# EAGLE design RPi-FabScan-HAT_v12 (EAGLE 7.7.0)
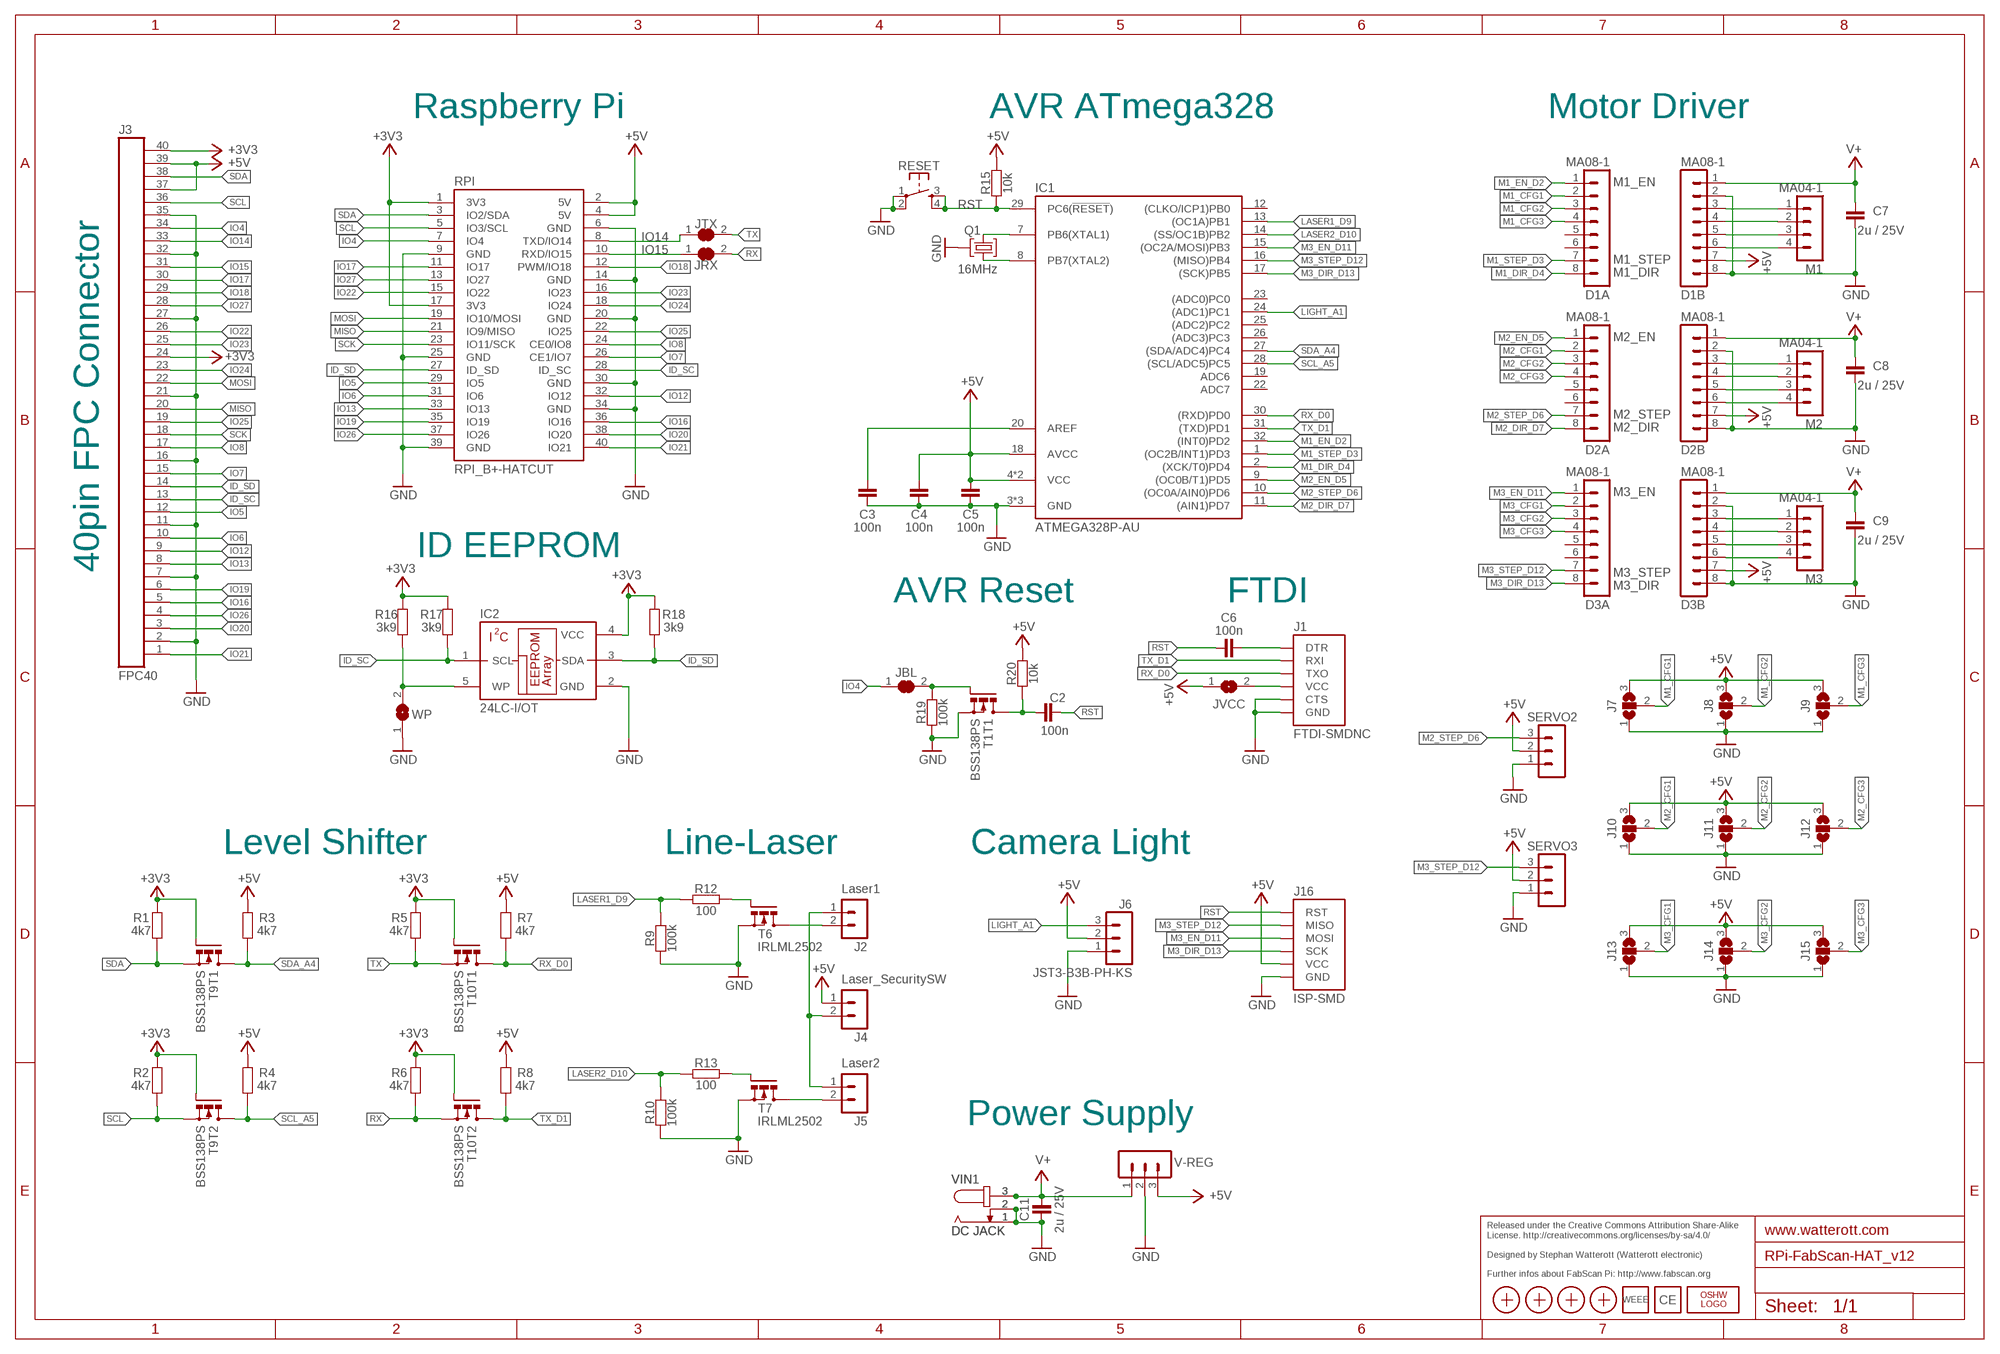
[diagram p0: schematic, sheet 1]

## Parts
1  PASSER-07  [PASSER_07MM]
2  PASSER-07  [PASSER_07MM]
C2  100n  CAPACITOR-0402  [C0402]
C3  100n  CAPACITOR-0402  [C0402]
C4  100n  CAPACITOR-0402  [C0402]
C5  100n  CAPACITOR-0402  [C0402]
C6  100n  CAPACITOR-0402  [C0402]
C7  2u / 25V  CAPACITOR-1206  [C1206]
C8  2u / 25V  CAPACITOR-1206  [C1206]
C9  2u / 25V  CAPACITOR-1206  [C1206]
C11  2u / 25V  CAPACITOR-1206  [C1206]
D1A  MA08-1  [MA08-1]
D1B  MA08-1  [MA08-1]
D2A  MA08-1  [MA08-1]
D2B  MA08-1  [MA08-1]
D3A  MA08-1  [MA08-1]
D3B  MA08-1  [MA08-1]
IC1  ATMEGA328P-AU  [TQFP32]
IC2  24LC-I/OT  [SOT23-5]
J1  FTDI-SMDNC  [FTDI_SMDNC]
J2  Laser1  MA02-1  [MA02-1]
J3  FPC40  [FPC40-0.5]
J4  Laser_SecuritySW  MA02-1  [MA02-1]
J5  Laser2  MA02-1  [MA02-1]
J6  JST3-B3B-PH-KS  [JST_B3B-PH-KS]
J7  JUMPER3-0603-NC  [JUMPER3-0603_NC]
J8  JUMPER3-0603-NC  [JUMPER3-0603_NC]
J9  JUMPER3-0603-NC  [JUMPER3-0603_NC]
J10  JUMPER3-0603-NC  [JUMPER3-0603_NC]
J11  JUMPER3-0603-NC  [JUMPER3-0603_NC]
J12  JUMPER3-0603-NC  [JUMPER3-0603_NC]
J13  JUMPER3-0603-NC  [JUMPER3-0603_NC]
J14  JUMPER3-0603-NC  [JUMPER3-0603_NC]
J15  JUMPER3-0603-NC  [JUMPER3-0603_NC]
J16  ISP-SMD  [ISP-2X3_SMD]
JBL  JUMPER2-0402-NC  [JUMPER2-0402_NC]
JRX  JUMPER2-0402-NC  [JUMPER2-0402_NC]
JTX  JUMPER2-0402-NC  [JUMPER2-0402_NC]
JVCC  JUMPER2-0402-NC  [JUMPER2-0402_NC]
LOGO1  LOGO_CE-2  [CE_2MM]
LOGO2  OSHW_LOGOX0100  [OSHW_6X100]
LOGO3  LOGO_WEEE-4  [WEEE_4MM]
M1  MA04-1  [MA04-1]
M2  MA04-1  [MA04-1]
M3  MA04-1  [MA04-1]
Q1  16MHz  CRYSTAL-RES-32  [CRYSTAL_32X13]
R1  4k7  RESISTOR-0402  [C0402]
R2  4k7  RESISTOR-0402  [C0402]
R3  4k7  RESISTOR-0402  [C0402]
R4  4k7  RESISTOR-0402  [C0402]
R5  4k7  RESISTOR-0402  [C0402]
R6  4k7  RESISTOR-0402  [C0402]
R7  4k7  RESISTOR-0402  [C0402]
R8  4k7  RESISTOR-0402  [C0402]
R9  100k  RESISTOR-0402  [C0402]
R10  100k  RESISTOR-0402  [C0402]
R12  100  RESISTOR-0402  [C0402]
R13  100  RESISTOR-0402  [C0402]
R15  10k  RESISTOR-0402  [C0402]
R16  3k9  RESISTOR-0402  [C0402]
R17  3k9  RESISTOR-0402  [C0402]
R18  3k9  RESISTOR-0402  [C0402]
R19  100k  RESISTOR-0402  [C0402]
R20  10k  RESISTOR-0402  [C0402]
RESET  SW-TACTILE-PTS840P  [SW_PTS840P]
RPI  RPI_B+-HATCUT  [RPI-B+HAT_CUTOUT]
SERVO2  MA03-1  [MA03-1]
SERVO3  MA03-1  [MA03-1]
T1  BSS138PS  [SOT363]
T6  IRLML2502  MOSFET-N-SOT23  [SOT23]
T7  IRLML2502  MOSFET-N-SOT23  [SOT23]
T9  BSS138PS  [SOT363]
T10  BSS138PS  [SOT363]
V-REG  MA03-1  [MA03-1]
VIN  DC JACK  DC-JACK-2.1  [DC-JACK]
VIN1  DC JACK  DC-JACK-2.1  [DC-JACK]
WP  JUMPER2-0402-NC  [JUMPER2-0402_NC]
X1  PASSER-07  [PASSER_07MM]
X4  PASSER-07  [PASSER_07MM]

## Nets
+3V3: IC2.4(VCC) J3.24 J3.40 R1.1 R2.1 R5.1 R6.1 R16.2 R17.2 R18.2 RPI.1(3V3) RPI.17(3V3) T9.2(T1:G) T9.5(T2:G) T10.2(T1:G) T10.5(T2:G)
+5V: C4.2 C5.2 D1B.7 D2B.7 D3B.7 IC1.4(VCC) IC1.6(VCC) IC1.18(AVCC) J3.37 J3.39 J4.1 J6.2 J7.3 J8.3 J9.3 J10.3 J11.3 J12.3 J13.3 J14.3 J15.3 J16.VCC JVCC.1 R3.1 R4.1 R7.1 R8.1 R15.2 R20.2 RPI.2(5V) RPI.4(5V) SERVO2.2 SERVO3.2 V-REG.3
GND: C3.1 C4.1 C5.1 C7.1 C8.1 C9.1 C11.1 D1B.2 D1B.8 D2B.2 D2B.8 D3B.2 D3B.8 IC1.3(GND) IC1.5(GND) IC1.21(GND) IC2.2(GND) J1.1-GND(GND) J1.2-CTS(CTS) J3.2 J3.7 J3.11 J3.16 J3.21 J3.27 J3.32 J3.35 J6.1 J7.1 J8.1 J9.1 J10.1 J11.1 J12.1 J13.1 J14.1 J15.1 J16.GND Q1.GND R9.1 R10.1 R19.1 RESET.1 RESET.2 RPI.6(GND) RPI.9(GND) RPI.14(GND) RPI.20(GND) RPI.25(GND) RPI.30(GND) RPI.34(GND) RPI.39(GND) SERVO2.1 SERVO3.1 T1.1(T1:S) T6.2(S) T7.2(S) V-REG.2 VIN1.1 VIN1.2 VIN.1 VIN.2 WP.1
ID_SC: IC2.1(SCL) J3.13 R17.1 RPI.28(ID_SC)
ID_SD: IC2.3(SDA) J3.14 R18.1 RPI.27(ID_SD)
IO4: J3.34 JBL.1 RPI.7(IO4)
IO5: J3.12 RPI.29(IO5)
IO6: J3.10 RPI.31(IO6)
IO7: J3.15 RPI.26(CE1/IO7)
IO8: J3.17 RPI.24(CE0/IO8)
IO12: J3.9 RPI.32(IO12)
IO13: J3.8 RPI.33(IO13)
IO14: J3.33 JTX.1 RPI.8(TXD/IO14)
IO15: J3.31 JRX.1 RPI.10(RXD/IO15)
IO16: J3.5 RPI.36(IO16)
IO17: J3.30 RPI.11(IO17)
IO18: J3.29 RPI.12(PWM/IO18)
IO19: J3.6 RPI.35(IO19)
IO20: J3.3 RPI.38(IO20)
IO21: J3.1 RPI.40(IO21)
IO22: J3.26 RPI.15(IO22)
IO23: J3.25 RPI.16(IO23)
IO24: J3.23 RPI.18(IO24)
IO25: J3.19 RPI.22(IO25)
IO26: J3.4 RPI.37(IO26)
IO27: J3.28 RPI.13(IO27)
LASER1_D9: IC1.13((OC1A)PB1) R9.2 R12.1
LASER2_D10: IC1.14((SS/OC1B)PB2) R10.2 R13.1
LIGHT_A1: IC1.24((ADC1)PC1) J6.3
M1_CFG1: D1A.2 J7.2
M1_CFG2: D1A.3 J8.2
M1_CFG3: D1A.4 J9.2
M1_DIR_D4: D1A.8 IC1.2((XCK/T0)PD4)
M1_EN_D2: D1A.1 IC1.32((INT0)PD2)
M1_STEP_D3: D1A.7 IC1.1((OC2B/INT1)PD3)
M2_CFG1: D2A.2 J10.2
M2_CFG2: D2A.3 J11.2
M2_CFG3: D2A.4 J12.2
M2_DIR_D7: D2A.8 IC1.11((AIN1)PD7)
M2_EN_D5: D2A.1 IC1.9((OC0B/T1)PD5)
M2_STEP_D6: D2A.7 IC1.10((OC0A/AIN0)PD6) SERVO2.3
M3_CFG1: D3A.2 J13.2
M3_CFG2: D3A.3 J14.2
M3_CFG3: D3A.4 J15.2
M3_DIR_D13: D3A.8 IC1.17((SCK)PB5) J16.SCK
M3_EN_D11: D3A.1 IC1.15((OC2A/MOSI)PB3) J16.MOSI
M3_STEP_D12: D3A.7 IC1.16((MISO)PB4) J16.MISO SERVO3.3
MISO: J3.20 RPI.21(IO9/MISO)
MOSI: J3.22 RPI.19(IO10/MOSI)
N$1: IC1.7(PB6(XTAL1)) Q1.2
N$2: IC1.8(PB7(XTAL2)) Q1.1
N$3: D3B.3 M3.1
N$5: C3.2 IC1.20(AREF)
N$6: R12.2 T6.1(G)
N$7: R13.2 T7.1(G)
N$9: C6.1 J1.6-DTR(DTR)
N$11: J2.1 J4.2 J5.1
N$12: JBL.2 R19.2 T1.2(T1:G)
N$14: C2.2 R20.1 T1.6(T1:D)
N$15: J2.2 T6.3(D)
N$17: D3B.4 M3.2
N$22: D3B.5 M3.3
N$23: D3B.6 M3.4
N$25: D2B.3 M2.1
N$26: D2B.4 M2.2
N$27: D2B.5 M2.3
N$28: D2B.6 M2.4
N$30: D1B.3 M1.1
N$31: D1B.4 M1.2
N$32: D1B.5 M1.3
N$33: D1B.6 M1.4
N$35: J5.2 T7.3(D)
N$36: IC2.5(WP) R16.1 WP.2
RST: C2.1 C6.2 IC1.29(PC6(!RESET!)) J16.RST R15.1 RESET.3(S1) RESET.4(S2)
RX: JRX.2 R6.2 T10.4(T2:S)
RX_D0: IC1.30((RXD)PD0) J1.4-TXO(TXO) R7.2 T10.6(T1:D)
SCK: J3.18 RPI.23(IO11/SCK)
SCL: J3.36 R2.2 RPI.5(IO3/SCL) T9.4(T2:S)
SCL_A5: IC1.28((SCL/ADC5)PC5) R4.2 T9.3(T2:D)
SDA: J3.38 R1.2 RPI.3(IO2/SDA) T9.1(T1:S)
SDA_A4: IC1.27((SDA/ADC4)PC4) R3.2 T9.6(T1:D)
TX: JTX.2 R5.2 T10.1(T1:S)
TX_D1: IC1.31((TXD)PD1) J1.5-RXI(RXI) R8.2 T10.3(T2:D)
V+: C7.2 C8.2 C9.2 C11.2 D1B.1 D2B.1 D3B.1 V-REG.1 VIN1.3 VIN.3
VCC_FTDI: J1.3-VCC(VCC) JVCC.2
Unconnected: D1A.5 D1A.6 D2A.5 D2A.6 D3A.5 D3A.6 IC1.12((CLKO/ICP1)PB0) IC1.19(ADC6) IC1.22(ADC7) IC1.23((ADC0)PC0) IC1.25((ADC2)PC2) IC1.26((ADC3)PC3) T1.3(T2:D) T1.4(T2:S) T1.5(T2:G)

## Notes on the sheet
- Raspberry Pi | AVR ATmega328 | Motor Driver
- M1_EN
- M1_STEP
- M1_DIR
- M2_EN
- 40pin FPC Connector
- M2_STEP
- M2_DIR
- M3_EN
- ID EEPROM
- M3_STEP
- M3_DIR
- AVR Reset | FTDI
- Level Shifter | Line-Laser | Camera Light
- Power Supply
- Released under the Creative Commons Attribution Share-Alike 
  License. http://creativecommons.org/licenses/by-sa/4.0/
  
  Designed by Stephan Watterott (Watterott electronic)
  
  Further infos about FabScan Pi: http://www.fabscan.org

## Library data of the parts
1 2 X1 X4 = we-symbol:PASSER
C2-C9 C11 = we-rcl:CAPACITOR: Capacitors ...2.2uF @ 6.3V -> 0402 ...4.7uF @ 6.3V -> 0603 ...10uF @ 16V -> 0805 ...22uF @ 25V -> 1206
D1A D1B D2A D2B D3A D3B = we-con:MA08-1: Pin Header
IC1 = we-chip:ATMEGA328P: Atmel ATmega48/88/168/328 AVR Microcontroller
IC2 = we-chip:24LC*: Microchip I2C EEPROM 2 Kbit - 24LC02B - 24LC02BT-I/OTDKR-ND 32 Kbit- 24LC32A - 24LC32AT-I/OTDKR-ND; DIGIKEY: 24LC32AT-I/OTDKR-ND
J1 = we-board:FTDI: FTDI 6pol connector
J2 J4 J5 = we-con:MA02-1: Pin Header
J3 = we-con:FPC40: FPC/ZIF Connector FCI 62684-402100AHLF -> 40 Pins 0.5mm top contact FCI 62684-401100AHLF -> 40 Pins 0.5mm bottom contact; DIGIKEY_BOT: 62684-401100AHLF-ND; DIGIKEY_TOP: 62684-402100AHLF-ND
J6 = we-con:JST3: JST Connector
J7-J15 = we-rcl:JUMPER3: 3 Pin Jumpers
J16 = we-board:ISP: AVR ISP connector
JBL JRX JTX JVCC WP = we-rcl:JUMPER2: 2 Pin Jumpers
LOGO1 = we-symbol:LOGO_CE: CE Logo
LOGO2 = we-symbol:OSHW_LOGO
LOGO3 = we-symbol:LOGO_WEEE: WEEE Logo
M1-M3 = we-con:MA04-1: Pin Header
Q1 = we-rcl:CRYSTAL-RES: Crystal Resonators 8MHz and 16MHz -> 32x13
R1-R10 R12 R13 R15-R20 = we-rcl:RESISTOR: Resistors all kinds in 0402 and 0603
RESET = we-switch:SW-TACTILE: Tactile Switches; DIGIKEY: CKN10511DKR-ND
RPI = we-board:RPI_B+: Raspberry Pi 1 B+ or Pi 2 or Pi 3 or Pi Zero
SERVO2 SERVO3 V-REG = we-con:MA03-1: Pin Header
T1 T9 T10 = we-transistor:BSS138PS: BSS138 Dual N-Channel MOSFET (UGS +/-20V, RDS 1Ohm, ID 320mA)
T6 T7 = we-transistor:MOSFET-N: N-Channel MOSFET (e.g. IRLML2502, BSS138)
VIN VIN1 = we-con:DC-JACK: DC Jack (2.1mm and 2.5mm)

## Board
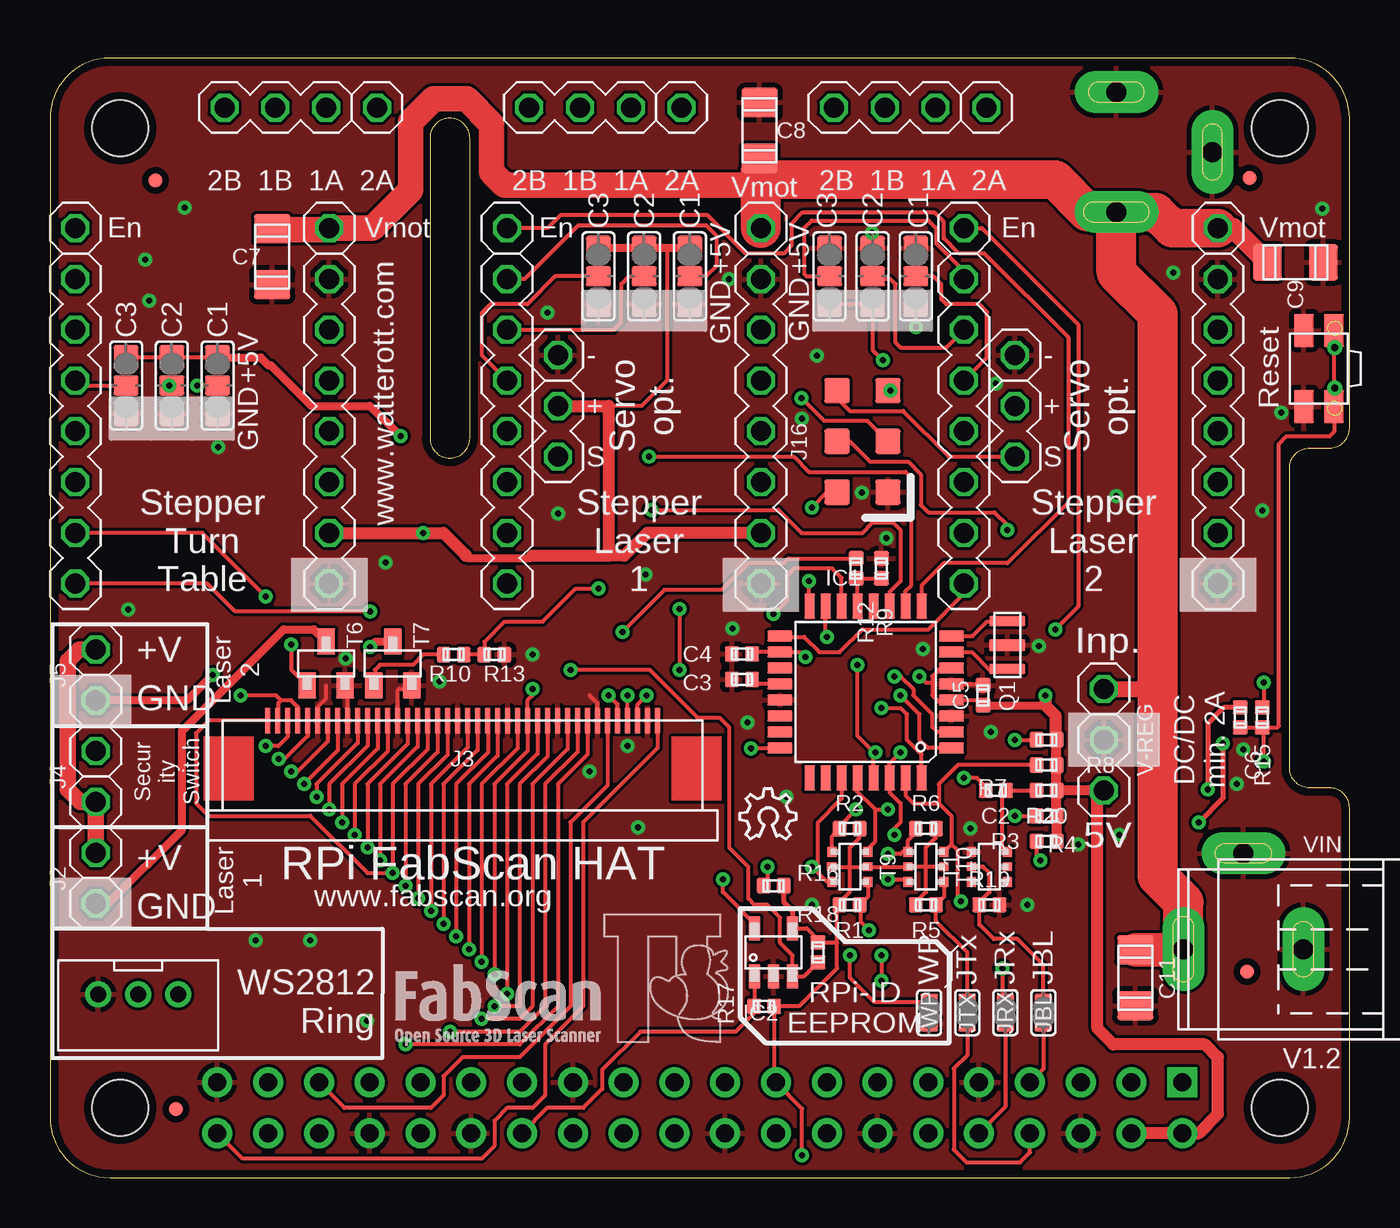
[diagram p1: board, top side]
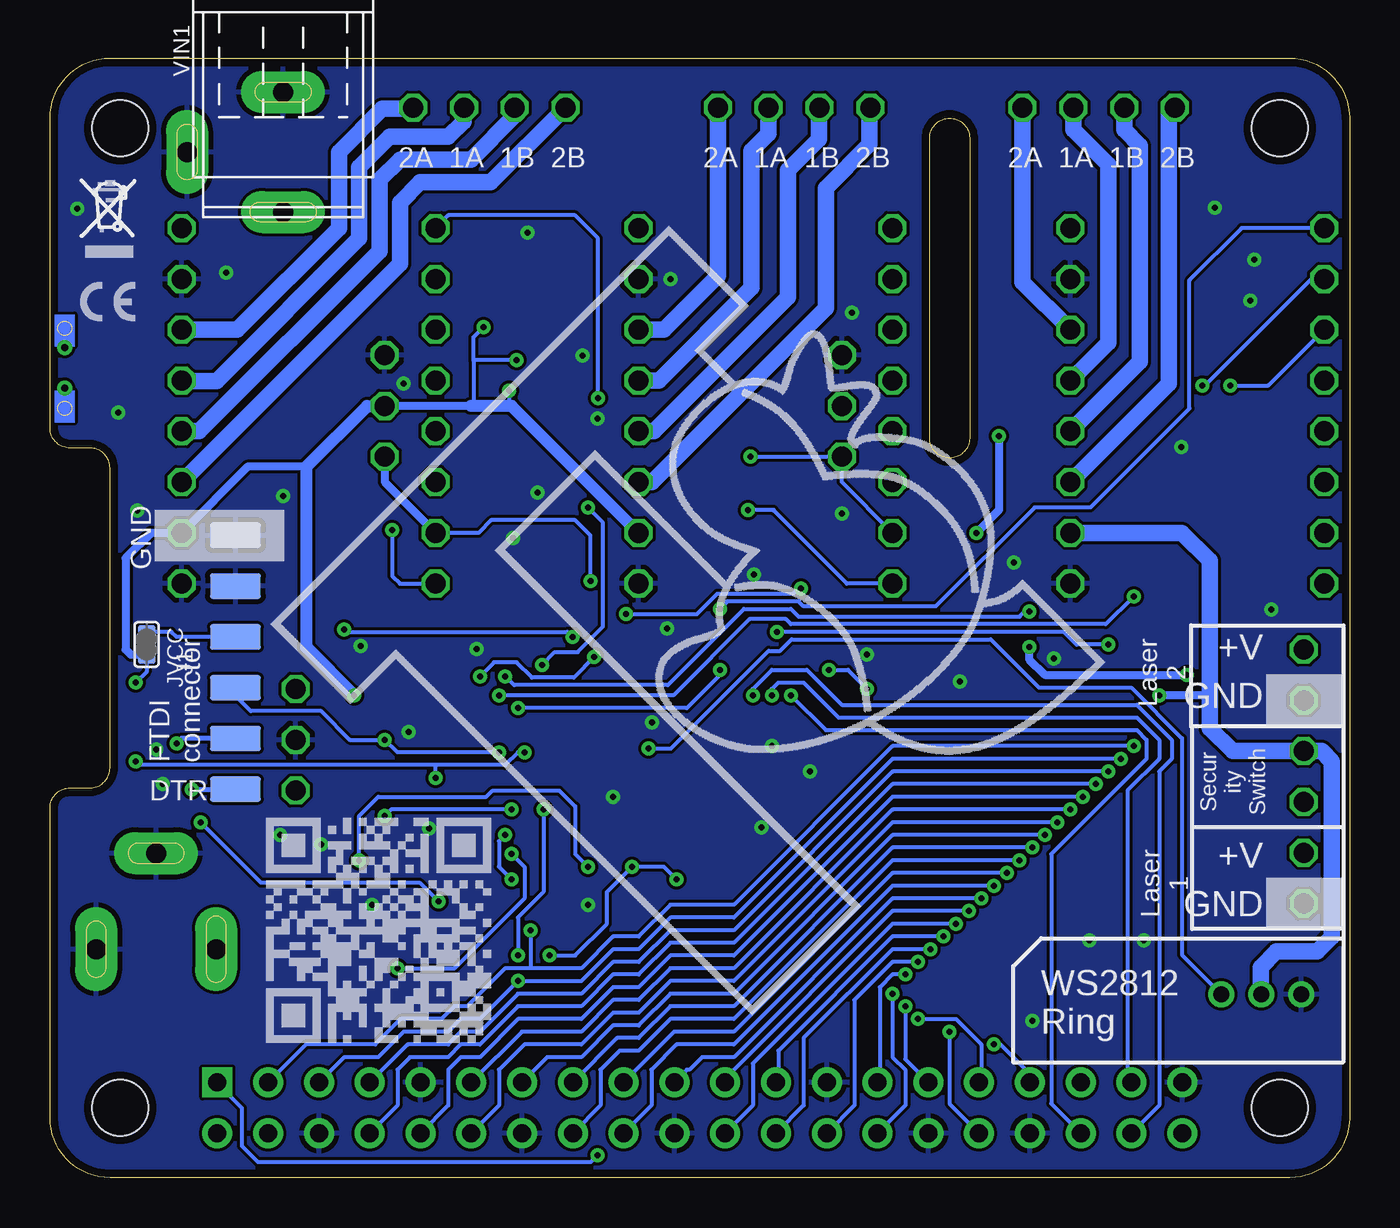
[diagram p2: board, bottom side, seen from below]

Size 65 x 56 mm. Coordinates in mm from the lower left corner, seen from the top.
Copper layers (1*16): Top 0.035mm / dielectric 1.5mm / Bottom 0.035mm
Design rules "we-dru-2-layer": minimum track width 0.15mm, minimum drill 0.3mm, track to track 0.15mm, track to pad 0.15mm, pad to pad 0.15mm, via to via 0.15mm, smd to smd 0.1mm, copper to edge 0.4mm, drill to drill 0.2mm, minimum pad ring 0.18mm, minimum via ring 0.2mm, stop-mask expansion 0.1mm, vias tented up to drill 0.5mm, thermal gap 0.25mm

### Footprints (pad centres in the part's own frame; a part is rotated, then mirrored left to right if it is on the bottom)
PASSER_07MM = smd 0.7 x 0.7: X 0,0
C0402 = smd 0.75 x 0.7: 1 0,0.5; 2 0,-0.5
C1206 = smd 1.8 x 1.45: 1 0,1.4; 2 0,-1.4
MA08-1 = drill 1 octagon: 1 0,8.89; 2 0,6.35; 3 0,3.81; 4 0,1.27; 5 0,-1.27; 6 0,-3.81; 7 0,-6.35; 8 0,-8.89
TQFP32 = smd 1.27 x 0.559: 1 -4.293,2.8; 2 -4.293,2; 3 -4.293,1.2; 4 -4.293,0.4; 5 -4.293,-0.4; 6 -4.293,-1.2; 7 -4.293,-2; 8 -4.293,-2.8; 17 4.293,-2.8; 18 4.293,-2; 19 4.293,-1.2; 20 4.293,-0.4; 21 4.293,0.4; 22 4.293,1.2; 23 4.293,2; 24 4.293,2.8 | smd 0.559 x 1.27: 9 -2.8,-4.293; 10 -2,-4.293; 11 -1.2,-4.293; 12 -0.4,-4.293; 13 0.4,-4.293; 14 1.2,-4.293; 15 2,-4.293; 16 2.8,-4.293; 25 2.8,4.293; 26 2,4.293; 27 1.2,4.293; 28 0.4,4.293; 29 -0.4,4.293; 30 -1.2,4.293; 31 -2,4.293; 32 -2.8,4.293
SOT23-5 = smd 1.2 x 0.6: 1 -1.2,0.95; 2 -1.2,0; 3 -1.2,-0.95; 4 1.2,-0.95; 5 1.2,0.95
FTDI_SMDNC = smd 2.54 x 1.27: 1-GND 0,6.35; 2-CTS 0,3.81; 3-VCC 0,1.27; 4-TXO 0,-1.27; 5-RXI 0,-3.81; 6-DTR 0,-6.35
MA02-1 = drill 1 octagon: 1 0,1.27; 2 0,-1.27
FPC40-0.5 = smd 1.27 x 0.279: 1 0,9.75; 2 0,9.25; 3 0,8.75; 4 0,8.25; 5 0,7.75; 6 0,7.25; 7 0,6.75; 8 0,6.25; 9 0,5.75; 10 0,5.25; 11 0,4.75; 12 0,4.25; 13 0,3.75; 14 0,3.25; 15 0,2.75; 16 0,2.25; 17 0,1.75; 18 0,1.25; 19 0,0.75; 20 0,0.25; 21 0,-0.25; 22 0,-0.75; 23 0,-1.25; 24 0,-1.75; 25 0,-2.25; 26 0,-2.75; 27 0,-3.25; 28 0,-3.75; 29 0,-4.25; 30 0,-4.75; 31 0,-5.25; 32 0,-5.75; 33 0,-6.25; 34 0,-6.75; 35 0,-7.25; 36 0,-7.75; 37 0,-8.25; 38 0,-8.75; 39 0,-9.25; 40 0,-9.75
JST_B3B-PH-KS = drill 0.8 pad 1.3: 1 0,2; 2 0,0; 3 0,-2
JUMPER3-0603_NC = smd 1.25 x 1.25: 1 0,1.4; 3 0,-1.4 | smd 1.25 x 1: 2 0,0
ISP-2X3_SMD = smd 1.27 x 1.27: GND 1.27,-2.54; MISO -1.27,2.54; MOSI 1.27,0; RST -1.27,-2.54; SCK -1.27,0; VCC 1.27,2.54
JUMPER2-0402_NC = smd 0.9 x 0.8: 1 0,0.55; 2 0,-0.55
MA04-1 = drill 1 octagon: 1 0,3.81; 2 0,1.27; 3 0,-1.27; 4 0,-3.81
CRYSTAL_32X13 = smd 1.8 x 0.5: 1 0,1.2; 2 0,-1.2 | smd 1.8 x 0.6: GND 0,0
SW_PTS840P = smd 1.65 x 1: 1 -1.9,0.75; 2 1.9,0.75; 3 -1.9,-0.75; 4 1.9,-0.75
RPI-B+HAT_CUTOUT = drill 0.9 pad 1.5 square: 1 56.63,4.77 | drill 0.9 pad 1.5: 2 56.63,2.23; 3 54.09,4.77; 4 54.09,2.23; 5 51.55,4.77; 6 51.55,2.23; 7 49.01,4.77; 8 49.01,2.23; 9 46.47,4.77; 10 46.47,2.23; 11 43.93,4.77; 12 43.93,2.23; 13 41.39,4.77; 14 41.39,2.23; 15 38.85,4.77; 16 38.85,2.23; 17 36.31,4.77; 18 36.31,2.23; 19 33.77,4.77; 20 33.77,2.23; 21 31.23,4.77; 22 31.23,2.23; 23 28.69,4.77; 24 28.69,2.23; 25 26.15,4.77; 26 26.15,2.23; 27 23.61,4.77; 28 23.61,2.23; 29 21.07,4.77; 30 21.07,2.23; 31 18.53,4.77; 32 18.53,2.23; 33 15.99,4.77; 34 15.99,2.23; 35 13.45,4.77; 36 13.45,2.23; 37 10.91,4.77; 38 10.91,2.23; 39 8.37,4.77; 40 8.37,2.23 | hole 2.8: 3.5,3.5; 3.5,52.5; 61.5,52.5; 61.5,3.5
MA03-1 = drill 1 octagon: 1 0,2.54; 2 0,0; 3 0,-2.54
SOT363 = smd 0.5 x 0.5: 1 -0.9,0.75; 3 -0.9,-0.75; 4 0.9,-0.75; 6 0.9,0.75 | smd 0.5 x 0.4: 2 -0.9,0; 5 0.9,0
SOT23 = smd 1.3 x 0.9: 1 -1.1,0.95; 2 -1.1,-0.95; 3 1.1,0
DC-JACK = drill 1 pad 2.1 long: 1 3,0; 2 0,4.8; 3 -3,0

### Placement (x,y rotation side)
1  6.3,3.44 0 top
2  59.87,10.3 0 top
C2  47.31,19.37 90 top
C3  34.61,24.92 90 top
C4  34.61,26.19 90 top
C5  46.67,24.13 0 top
C6  59.53,23.02 0 top
C7  11.11,46.07 180 top
C8  35.5,52.39 0 top
C9  62.29,45.78 270 top
C11  54.29,10 180 top
D1A  1.27,38.61 0 top
D1B  13.97,38.61 0 top
D2A  22.86,38.61 0 top
D2B  35.56,38.61 0 top
D3A  45.72,38.61 0 top
D3B  58.42,38.61 0 top
IC1  40.8,24.29 180 top
IC2  36.2,11.27 90 top
J1  55.72,25.78 0 bottom
J2  2.29,14.99 0 top
J3  20.64,22.86 270 top
J4  2.29,20.07 0 top
J5  2.29,25.15 0 top
J6  4.41,9.18 90 top
J7  8.38,39.62 180 top
J8  6.1,39.62 180 top
J9  3.81,39.62 180 top
J10  32,45.09 180 top
J11  29.72,45.09 180 top
J12  27.43,45.09 180 top
J13  38.99,45.09 0 top
J14  41.15,45.09 0 top
J15  43.31,45.09 0 top
J16  40.64,36.83 0 top
JBL  49.69,8.26 180 top
JRX  47.78,8.26 180 top
JTX  45.88,8.26 180 top
JVCC  60.17,26.67 180 bottom
LOGO1  62.1,43.81 0 bottom
LOGO2  34.5,16.94 0 top
LOGO3  62.1,48.01 0 bottom
M1  12.54,53.53 270 top
M2  27.78,53.53 270 top
M3  43.02,53.53 270 top
Q1  47.88,26.64 0 top
R1  40.01,13.65 90 top
R2  40.01,17.46 270 top
R3  49.85,16.83 270 top
R4  49.85,18.1 270 top
R5  43.81,13.65 90 top
R6  43.81,17.46 270 top
R7  49.85,21.91 270 top
R8  49.85,20.64 270 top
R9  41.59,30.48 0 top
R10  22.23,26.16 270 top
R12  40.32,30.48 180 top
R13  20.19,26.16 270 top
R15  60.64,23.02 180 top
R16  36.2,14.61 90 top
R17  35.72,8.57 90 top
R18  38.42,11.27 180 top
R19  46.99,13.65 270 top
R20  49.85,19.37 90 top
RESET  63.47,40.48 90 top
RPI  0,0 0 top
SERVO2  25.4,38.61 0 top
SERVO3  48.26,38.61 0 top
T1  46.99,15.56 0 top
T6  13.81,25.72 90 top
T7  17.14,25.72 90 top
T9  40.01,15.56 180 top
T10  43.81,15.56 180 top
V-REG  52.7,21.91 0 top
VIN  59.69,11.43 0 top
VIN1  53.34,51.31 90 bottom
WP  43.97,8.26 180 top
X1  5.29,49.87 0 top
X4  60,50 0 top

### Tracks (layer width: path | path; a pad name or v marks a point on that pad's centre or on a via)
+3V3  (via drill 0.3)
  Top 0.2: J3.24 18.89,21.43 17.14,19.68 v17.14,15.24 15.88,15.24 13.02,18.1 7.94,18.1 7.3,18.73 7.3,22.23 7.94,22.86 J3.40 | T10.2 43.81,15.56 | 43.81,15.56 T10.5 T9.2 40.01,15.56 | T9.5 40.01,15.56 | 39.45,13.74 39.51,13.79 | 39.51,13.79 40.01,14.29 40.01,15.56 | 43.81,15.56 43.81,14.29 43.27,13.74 43.27,13.7 R5.1 | 39.37,11.75 39.37,10.48 37.47,8.57 R17.2 36.22,4.86 RPI.17 | 39.37,11.75 39.37,13.57 39.45,13.65 R1.1 39.51,13.79 | IC2.4 37.85,12.47 38.42,11.91 R18.2 39.35,11.77 39.37,11.75 | 36.27,4.81 RPI.17 | v37.62,1.11 37.62,3.46 RPI.17 | 43.81,15.56 43.81,16.51 44.29,16.99 44.29,17.44 R6.1 | 40.01,15.56 40.01,16.51 40.48,16.99 40.48,17.44 R2.1 | 36.7,13.79 36.74,13.74
  Top 0.254: 36.74,13.74 37.15,13.34 IC2.4 | R16.2 36.7,13.79
  Bottom 0.2: v17.14,15.24 22.86,15.24 30.8,7.3 33.78,7.3 RPI.17 | RPI.1 56.63,4.72 55.4,3.49 55.4,1.59 54.61,0.79 37.94,0.79 v37.62,1.11
+5V  (via drill 0.3)
  Top 0.2: IC1.6 44.54,25.49 44.13,25.08 44.13,24.77 | 44.13,24.77 44.13,24.13 44.45,23.81 45.02,23.81 IC1.4 46.41,23.89 C5.2 | v37.78,26.04 37.53,26.29 IC1.18 35.2,26.29 C4.2 | v43.5,25.08 43.81,24.77 44.13,24.77 | J7.3 J8.3 J9.3 | v60.71,24.77 60.71,23.58 R15.2 | J3.37 12.39,23.55 12.06,23.88 11.56,23.88 | J3.39 11.39,23.33 11.43,23.37 11.43,23.75 11.56,23.88 | v9.53,24.13 11.3,24.13 11.56,23.88 | J12.3 30.86,46.48 30.86,39.88 29.59,38.61 27.94,38.61 | J13.3 J14.3 41.15,41.4 v41.66,40.89 | v43.31,42.55 J15.3 | J16.VCC v42.04,39.37
  Top 0.254: 43.31,43.24 43.5,43.24 43.5,43.69 J15.3 43.31,44.07
  Top 0.406: J7.3 10.54,41.02 10.92,40.64 11.05,40.64 13.08,38.61 16,38.61 v17.53,37.08 | C5.2 49.78,23.63 49.78,23.64 | 50.29,21.96 R7.1 | J10.3 J11.3 J12.3 | 24.13,31.11 24,30.99 20.92,30.99 20.8,31.11
  Top 0.5: V-REG.3 R20.2 | R20.2 R8.1 R7.1 | R20.2 R4.1 R3.1
  Top 0.61: V-REG.3 52.39,19.05 52.39,7.46 53.18,6.67 57.78,6.67 58.42,6.03 58.42,3.17 57.48,2.23 RPI.2 RPI.4 | D1B.7 v18.67,32.26 19.68,32.26 20.8,31.15 20.8,31.11 | 49.78,23.63 50.29,23.11 50.29,21.96 | v49.78,24.13 49.78,23.64 | SERVO2.2 27.94,38.61 27.94,31.11 | D2B.7 29.88,32.26 28.73,31.11 27.94,31.11 | 24.13,31.11 27.94,31.11
  Bottom 0.2: JVCC.1 60.17,25.3 v60.71,24.77 | 43.81,40.89 43.81,38.73 43.94,38.61 | v41.66,40.89 43.81,40.89 | 43.81,40.89 43.81,42.04 v43.31,42.55 | v42.04,39.37 42.04,38.61 | v37.78,26.04 38.8,25.02 40.89,25.02 41.66,25.78 42.8,25.78 v43.5,25.08
  Bottom 0.406: v17.53,37.08 17.53,33.4 v18.67,32.26 | JVCC.1 60.21,26.16 60.96,26.16 61.21,26.42 61.21,30.99 59.94,32.26 D3B.7 55.12,35.56 52.2,35.56 | 43.94,38.61 SERVO3.2 | 6.99,24.13 v9.53,24.13
  Bottom 0.61: SERVO3.2 49.15,38.61 52.2,35.56 52.2,26.54 v49.78,24.13 | D2B.7 41.91,38.61 42.04,38.61 43.94,38.61
  Bottom 0.813: D1B.7 8.38,32.26 6.99,30.86 6.99,24.13 6.99,22.48 5.84,21.34 J4.1 1.4,21.34 0.89,20.83 0.89,12.04 1.62,11.31 3.66,11.31 4.44,10.53 4.44,9.21 J6.2
GND  (via drill 0.3)
  Top 0.2: J3.7 27.39,23.73 26.99,24.13 | J3.32 14.89,24.49 T6.2 14.75,24.61 | IC1.5 46.66,24.69 | J3.27 17.39,24.37 17.46,24.45 18.08,24.45 | J3.35 13.39,23.55 13.81,23.97 13.81,24.61
  other vias: 25.4,33.21 48.9,13.65 46.04,17.46 38.1,13.65 29.4,17.53 28.89,21.59 26.99,20.32 24.13,26.16 19.49,24.83 14.8,25.97 4.95,43.88 4.76,45.91 6.73,48.51 15.87,7.85 13.02,11.87 10.29,11.87 36.83,19.05 49.47,26.61 37.62,37.97 34.13,27.46 8.41,36.54 33.97,44.96 41.12,47.28 47.31,39.72 41.85,32 38.35,41.12 56.2,45.28 63.63,48.48 61.59,38.26 59.37,19.68 53.5,17.14 51.44,16.67 3.91,28.42 29.78,30.16 16.8,30.77 60.64,33.37 59.69,21.43 53.34,34.1 40.61,34.26 47.05,22.29 24.89,43.28 34.89,22.76 43.66,26.45
  pour Top: 0,0 0,55.88 65.09,55.88 65.09,0
  pour Bottom: 0,0 0,55.88 0,56.04 64.93,56.04 64.93,55.88 64.93,50.8 64.93,33.02 64.93,21.91 64.93,12.06 64.93,2.38 64.93,0
ID_SC  (via drill 0.3)
  Top 0.2: J3.13 24.39,21.21 22.86,19.68 v22.86,9.21 | IC2.1 35.24,8.6 R17.1 35.22,8.23 34.29,7.3 29.53,7.3 27.62,5.4 27.62,4.45 26.67,3.49 24.87,3.49 RPI.28
  Bottom 0.2: v22.86,9.21 22.86,6.03 22.23,5.4 22.23,3.62 RPI.28
ID_SD  (via drill 0.3)
  Top 0.2: v22.23,10.16 22.23,19.68 23.89,21.35 J3.14 23.89,23.89 24.13,24.13 v24.13,24.45 | v26.04,25.4 30,25.4 32.38,23.02 33.5,23.02 33.97,22.54 33.97,16.51 34.92,15.56 34.92,13.97 35.24,13.65 35.88,13.65 36.51,13.02 36.51,11.75 37.15,11.12 IC2.3 37.72,10.07 R18.1
  Bottom 0.2: v22.23,10.16 22.86,10.16 23.5,9.53 23.5,4.88 RPI.27 | v26.04,25.4 25.08,25.4 v24.13,24.45
IO4  (via drill 0.3)
  Top 0.2: J3.34 13.89,21.82 12.38,20.32 v12.06,20.32 | JBL.1 49.69,5.45 RPI.7
  Bottom 0.2: v12.06,20.32 22.86,20.32 30.8,12.38 33.97,12.38 35.56,10.79 36.83,10.79 38.42,9.21 41.59,9.21 43.5,7.3 44.45,7.3 45.09,6.67 47.11,6.67 RPI.7
IO5  (via drill 0.3)
  Top 0.2: J3.12 24.89,21.08 23.5,19.68 23.5,8.57 v22.23,8.57
  Bottom 0.2: v22.23,8.57 22.23,5.92 RPI.29
IO6  (via drill 0.3)
  Top 0.2: J3.10 25.89,21.44 24.13,19.68 24.13,8.57 23.5,7.94 v21.59,7.94
  Bottom 0.2: v21.59,7.94 19.68,7.94 18.41,6.67 18.41,4.76 RPI.31
IO7  (via drill 0.3)
  Top 0.2: J3.15 23.39,21.48 21.59,19.68 v21.59,10.79
  Bottom 0.2: v21.59,10.79 22.86,10.79 24.77,8.89 24.77,3.62 RPI.26
IO8  (via drill 0.3)
  Top 0.2: J3.17 22.39,21.12 20.95,19.68 v20.95,11.43
  Bottom 0.2: v20.95,11.43 22.86,11.43 27.3,6.99 27.3,3.62 RPI.24
IO12  (via drill 0.3)
  Top 0.2: J3.9 26.39,21.31 24.77,19.68 24.77,8.57 23.5,7.3 v20,7.3
  Bottom 0.2: v20,7.3 20,3.7 RPI.32
IO13  (via drill 0.3)
  Top 0.2: J3.8 26.89,21.17 25.4,19.68 25.4,8.57 23.5,6.67 v17.78,6.67
  Bottom 0.2: RPI.33 16.19,4.97 16.19,5.4 17.46,6.67 v17.78,6.67
IO14  (via drill 0.3)
  Top 0.2: J3.33 14.39,21.37 v12.7,19.68 | JTX.1 45.88,6.13 45.21,5.46 45.21,1.4 45.85,0.76 48.51,0.76 49.02,1.27 49.02,2.22 RPI.8
  Bottom 0.2: v12.7,19.68 22.86,19.68 30.8,11.75 33.97,11.75 35.56,10.16 36.83,10.16 38.42,8.57 41.59,8.57 43.5,6.67 44.45,6.67 45.09,6.03 46.99,6.03 47.62,5.4 47.62,3.62 RPI.8
IO15  (via drill 0.3)
  Top 0.2: J3.31 15.39,21.74 13.34,19.68 v13.34,19.05 | JRX.1 47.78,3.54 RPI.10
  Bottom 0.2: v13.34,19.05 22.86,19.05 30.8,11.11 33.97,11.11 35.56,9.53 36.83,9.53 38.42,7.94 41.59,7.94 43.5,6.03 44.45,6.03 45.09,5.4 45.09,3.62 RPI.10
IO16  (via drill 0.3)
  Top 0.2: J3.5 28.39,23.68 v27.94,24.13
  Bottom 0.2: v27.94,24.13 26.19,22.38 10.64,22.38 10.16,21.91 10.16,20.95 14.92,16.19 14.92,3.7 RPI.36
IO17  (via drill 0.3)
  Top 0.2: J3.30 15.89,21.6 13.97,19.68 v13.97,18.41
  Bottom 0.2: v13.97,18.41 22.86,18.41 30.8,10.48 33.97,10.48 35.56,8.89 36.83,8.89 38.42,7.3 41.4,7.3 RPI.11
IO18  (via drill 0.3)
  Top 0.2: J3.29 16.39,21.47 14.61,19.68 v14.61,17.78
  Bottom 0.2: v14.61,17.78 22.86,17.78 30.8,9.84 33.97,9.84 35.56,8.26 36.83,8.26 38.42,6.67 41.27,6.67 42.55,5.4 42.55,3.62 RPI.12
IO19
  Top 0.2: J3.6 27.89,19.63 26.04,17.78 26.04,8.57 23.5,6.03 20.64,6.03 19.68,5.08 19.68,4.13 19.05,3.49 14.73,3.49 RPI.35
IO20  (via drill 0.3)
  Top 0.2: J3.3 29.39,23.67 v29.84,24.13
  Bottom 0.2: v29.84,24.13 29.84,24.45 28.89,25.4 27.15,25.4 25.4,23.65 10.64,23.65 8.89,21.91 8.89,20.95 9.53,20.32 9.53,3.62 RPI.38
IO21
  Top 0.2: J3.1 30.39,21.5 26.67,17.78 26.67,8.57 24.77,6.67 24.77,4.13 24.13,3.49 22.86,3.49 22.23,2.86 22.23,1.59 21.59,0.95 9.65,0.95 RPI.40
IO22  (via drill 0.3)
  Top 0.2: J3.26 17.89,21.7 15.88,19.68 v15.88,16.51
  Bottom 0.2: v15.88,16.51 22.86,16.51 30.8,8.57 33.97,8.57 35.56,6.99 36.63,6.99 RPI.15
IO23  (via drill 0.3)
  Top 0.2: J3.25 18.39,21.56 16.51,19.68 v16.51,15.88
  Bottom 0.2: v16.51,15.88 22.86,15.88 30.8,7.94 33.97,7.94 35.56,6.35 36.51,6.35 37.47,5.4 37.47,3.62 RPI.16
IO24  (via drill 0.3)
  Top 0.2: J3.23 19.39,21.29 17.78,19.68 v17.78,14.61
  Bottom 0.2: v17.78,14.61 22.86,14.61 30.8,6.67 33.66,6.67 34.92,5.4 34.92,3.62 RPI.18
IO25  (via drill 0.3)
  Top 0.2: J3.19 21.39,21.39 19.68,19.68 v19.68,12.7
  Bottom 0.2: v19.68,12.7 22.86,12.7 29.84,5.71 29.84,3.62 RPI.22
IO26  (via drill 0.3)
  Top 0.2: J3.4 v28.89,24.12 v28.89,24.13
  Bottom 0.2: v28.89,24.13 28.89,24.45 28.57,24.77 27.3,24.77 25.56,23.02 10.64,23.02 9.53,21.91 9.53,20.95 11.11,19.37 11.11,4.97 RPI.37
IO27  (via drill 0.3)
  Top 0.2: J3.28 16.89,21.33 15.24,19.68 v15.24,17.14
  Bottom 0.2: v15.24,17.14 22.86,17.14 30.8,9.21 33.97,9.21 35.56,7.62 36.83,7.62 38.42,6.03 40.13,6.03 RPI.13
LASER1_D9
  Top 0.2: IC1.13 40.4,29.85 40.51,29.85 40.64,29.98 | R12.1 40.64,29.98 | 40.64,29.98 R9.2
LASER2_D10  (via drill 0.3)
  Top 0.2: R13.1 R10.2 21.73,26.8 22.73,27.81 24.64,27.81 26.29,29.46 v27.43,29.46 | IC1.14 39.6,30 39.12,30.48 37.21,30.48 36.83,30.1 36.83,28.83 v36.2,28.19
  Bottom 0.2: v36.2,28.19 32.64,28.19 31.62,29.21 27.81,29.21 27.56,29.46 v27.43,29.46
LIGHT_A1  (via drill 0.3)
  Top 0.2: IC1.24 36.48,21.46 v35.05,21.46
  Bottom 0.2: J6.3 8.38,11.15 8.38,21.97 10.92,24.51 15.53,24.51 17.94,26.92 27.91,26.92 28.48,26.35 29.05,26.35 33.94,21.46 v35.05,21.46
M1_CFG1  (via drill 0.3)
  Top 0.2: J7.2 v7.37,39.62
  Bottom 0.2: v7.37,39.62 7.24,39.62 1.91,44.96 D1A.2
M1_CFG2  (via drill 0.3)
  Top 0.2: J8.2 v5.97,39.62
  Bottom 0.2: v5.97,39.62 4.06,39.62 D1A.3
M1_CFG3
  Top 0.2: D1A.4 1.52,39.62 J9.2
M1_DIR_D4  (via drill 0.3)
  Top 0.2: IC1.2 44.39,22.29 44.13,22.54 44.13,23.18 43.18,24.13 43.18,24.45 42.55,25.08 v42.23,25.08 | v16,28.32 9.27,28.32 7.87,29.72 D1A.8
  Bottom 0.2: v42.23,25.08 41.78,24.64 34.1,24.64 30.29,28.45 27.94,28.45 27.56,28.07 16.51,28.07 16.26,28.32 v16,28.32
M1_EN_D2  (via drill 0.3)
  Top 0.2: IC1.32 43.6,21.17 42.86,21.91 42.86,23.18 42.55,23.5 v41.59,23.5 | v31.5,28.45 v31.5,25.4
  Bottom 0.2: D1A.1 5.4,47.5 8,44.9 8,38.48 12.95,33.53 15.75,33.53 20.7,28.57 27.3,28.57 27.56,28.83 31.11,28.83 v31.5,28.45 | v41.59,23.5 33.15,23.5 31.5,25.15 v31.5,25.4
M1_STEP_D3  (via drill 0.3)
  Top 0.2: IC1.1 43.92,21.49 43.5,21.91 43.5,23.18 v42.55,24.13 | v10.79,29.08 7.62,32.26 D1A.7
  Bottom 0.2: v42.55,24.13 33.81,24.13 30,27.94 28.19,27.94 27.94,27.69 12.19,27.69 v10.79,29.08
M2_CFG1
  Top 0.2: D2A.2 23.75,44.96 26.42,47.62 32.84,47.62 33.33,47.13 33.33,45.6 32.82,45.09 J10.2
M2_CFG2
  Top 0.2: D2A.3 28.19,42.42 28.57,42.8 28.57,44.7 28.96,45.09 J11.2
M2_CFG3
  Top 0.2: J12.2 25.27,45.09 23.88,43.69 22.04,43.69 21.59,43.24 21.59,41.15 D2A.4
M2_DIR_D7  (via drill 0.3)
  Top 0.2: IC1.11 42,29.3 42.55,29.84 42.55,32.38 42.16,32.77 41.15,32.77 40.64,32.26 37.59,32.26 36.45,33.4 v30.1,33.4
  Bottom 0.2: D2A.8 25.15,29.72 28.8,33.37 28.8,33.4 v30.1,33.4
M2_EN_D5
  Top 0.2: IC1.9 43.6,29.63 44.7,30.73 47.88,30.73 50.93,33.78 50.93,42.04 46.74,46.23 45.47,46.23 44.7,46.99 44.7,47.82 44.26,48.26 37.62,48.26 37.08,47.72 37.08,46.61 36.7,46.23 34.8,46.23 32.89,48.13 25.53,48.13 24.89,47.5 D2A.1
M2_STEP_D6  (via drill 0.3)
  Top 0.2: IC1.10 42.8,29.34 43.05,29.59 43.05,35.05 42.8,35.31 37.97,35.31 37.21,36.07 v29.97,36.07
  Bottom 0.2: D2A.7 25.4,34.8 SERVO2.3 v29.97,36.07
M3_CFG1
  Top 0.2: D3A.2 45.59,44.96 45.59,45.47 44.32,46.74 44.32,47.5 43.94,47.88 38.1,47.88 37.72,47.5 37.72,45.21 37.85,45.09 J13.2
M3_CFG2
  Top 0.2: 41.53,45.09 J14.2 41.27,44.96 42.04,44.96 42.29,44.7 42.29,41.78 42.55,41.53 44.83,41.53 D3A.3
M3_CFG3
  Top 0.2: D3A.4 46.86,41.02 46.86,43.31 46.48,43.69 44.83,43.69 44.58,43.94 44.58,44.7 44.2,45.09 J15.2
M3_DIR_D13  (via drill 0.3)
  Top 0.2: IC1.17 36.54,27.05 37.72,27.05 38.48,26.29 39.5,26.29 40.64,27.43 43.94,27.43 45.72,29.21 D3A.8 | J16.SCK 40.01,36.83 41.02,35.81 42.93,35.81 43.56,35.18 43.56,33.66 43.94,33.27 47.24,33.27 47.88,32.64 v47.88,32.38
  Bottom 0.2: v47.88,32.38 47.88,30.1 47.5,29.72 D3A.8
M3_EN_D11  (via drill 0.3)
  Top 0.2: D3A.1 46.61,47.5 51.44,42.67 51.44,28.57 v50.29,27.43 | v38.86,27.05 38.8,27.11 IC1.15 | J16.MOSI 40.89,37.85 38.73,37.85 v37.59,38.99
  Bottom 0.2: v38.86,27.05 39.12,27.3 50.16,27.3 v50.29,27.43 | v37.59,38.99 37.59,46.99 38.73,48.13 45.09,48.13 D3A.1
M3_STEP_D12  (via drill 0.3)
  Top 0.2: IC1.16 37.97,28.61 v37.97,29.84 | J16.MISO 39.37,38.99 40.01,38.35 42.67,38.35 44.96,36.07 SERVO3.3
  Bottom 0.2: v37.97,29.84 37.97,32.13 38.73,32.89 42.93,32.89 43.56,32.26 D3A.7
  Bottom 0.406: SERVO3.3 48.26,34.8 D3A.7
MISO  (via drill 0.3)
  Top 0.2: J3.20 20.89,21.52 19.05,19.68 v19.05,13.34
  Bottom 0.2: v19.05,13.34 22.86,13.34 31.11,5.08 31.11,4.88 RPI.21
MOSI  (via drill 0.3)
  Top 0.2: J3.22 19.89,21.16 18.41,19.68 v18.41,13.97
  Bottom 0.2: v18.41,13.97 22.86,13.97 30.8,6.03 32.38,6.03 33.02,5.4 33.14,5.4 RPI.19
N$1
  Top 0.2: IC1.7 46.1,26.29 46.99,25.4 47.84,25.4 Q1.2
N$2
  Top 0.2: IC1.8 46.14,27.09 46.86,27.81 47.85,27.81 Q1.1
N$3
  Bottom 0.813: M3.1 46.9,53.47 48.39,53.47 50.55,51.31 50.55,47.5 55.63,42.42 D3B.3
N$5
  Top 0.2: IC1.20 35.34,24.69 C3.2
N$6  (via drill 0.3)
  Top 0.2: v12.06,26.67 12.06,25.41 T6.1 | v28.64,27.3 30.73,29.4 33.59,29.4 34.92,30.73 36.7,30.73 36.95,30.98 R12.2
  Bottom 0.2: v12.06,26.67 13.65,26.67 14.29,27.3 v28.64,27.3
N$7
  Top 0.2: R13.2 18.67,26.16 18.16,25.65 16.51,25.65 16.26,25.4 16.26,24.56 | 16.26,24.52 16.26,24.56 | 16.26,24.56 T7.1
N$8
  Top 0.254: 45.85,7.91 45.85,8.48
N$9  (via drill 0.3)
  Top 0.254: C6.1 58.7,23.52 57.91,22.73 v57.91,19.43
  Bottom 0.254: v57.91,19.43 J1.6-DTR
N$10
  Top 0.254: 47.75,7.91 47.75,8.6
N$11
  Top 0.813: J5.1 1.46,26.42 0.89,25.84 0.89,19.43 1.52,18.8 J4.2 J2.1
N$12
  Top 0.2: T1.2 46.67,15.56 46.99,15.24 46.99,14.29 46.44,13.74 46.44,13.7 R19.2 46.48,12.67 47.21,11.94 48.39,11.94 49.69,10.64 JBL.2
N$13
  Top 0.254: 49.66,7.87 49.66,8.64
N$14
  Top 0.2: R20.1 C2.2 47.62,19.18 47.62,16.51 47.83,16.31 T1.6
N$15
  Top 0.406: T6.3 13.2,27.43 11.68,27.43 6.6,22.35 6.6,17.4 2.92,13.72 J2.2
N$17
  Bottom 0.813: M3.2 44.32,53.5 44.32,52.83 45.09,52.07 48.01,52.07 49.53,50.55 49.53,46.99 56.67,39.85 58.39,39.85 D3B.4
N$22
  Bottom 0.813: M3.3 41.75,53.12 43.94,50.93 47.5,50.93 48.51,49.91 48.51,46.35 57.53,37.34 D3B.5
N$23
  Bottom 0.813: M3.4 42.96,49.78 46.48,49.78 47.5,48.77 47.5,45.72 D3B.6
N$25
  Bottom 0.813: D2B.3 34.29,42.42 31.59,45.12 M2.1
N$26
  Bottom 0.813: D2B.4 34.54,39.88 29.91,44.51 29.91,51.37 29.05,52.23 M2.2
N$27
  Bottom 0.813: D2B.5 34.8,37.34 28.1,44.04 28.1,50.39 26.54,51.94 26.54,53.5 M2.3
N$28
  Bottom 0.813: M2.4 24,53.5 24,51.69 26.19,49.5 26.19,43.5 34.89,34.8 D2B.6
N$30
  Bottom 0.813: D1B.3 16.35,44.8 M1.1
N$31
  Bottom 0.813: D1B.4 12.06,41.78 12.06,50.67 13.81,52.42 M1.2
N$32
  Bottom 0.813: D1B.5 10.48,40.83 10.48,51.63 11.27,52.42 M1.3
N$33
  Bottom 0.813: D1B.6 9.05,39.72 9.05,53.18 8.73,53.5 M1.4
N$35  (via drill 0.3)
  Top 0.406: v8.13,25.15 6.86,23.88 J5.2 | v16,26.54 16.28,26.82 T7.3
  Bottom 0.406: v16,26.54 16,25.91 15.24,25.15 v8.13,25.15
N$36  (via drill 0.3)
  Top 0.2: v40.01,11.11 40.01,10 41.2,8.8 WP.2 | IC2.5 35.24,12.7 33.66,14.29 v33.66,14.92 | v35.88,15.56 35.88,14.79 R16.1
  Bottom 0.2: v40.01,11.11 38.73,11.11 37.15,12.7 37.15,14.29 v35.88,15.56 34.29,15.56 v33.66,14.92
RST  (via drill 0.3, 0.35)
  Top 0.152: v64.26,41.53 64.26,42.25 64.22,42.29 | v64.26,39.5 64.26,38.91 64.22,38.86
  Top 0.2: IC1.29 41.2,21.2 v41.27,21.27 41.21,21.27 40.39,22.1 v40.39,25.65 | v45.72,20 46.35,20 46.81,19.55 C2.1 | C6.2 R15.1 | v60.71,20.83 60.71,22.45 R15.1 | R15.1 61.38,22.52 61.47,22.61 61.47,36.7 61.85,37.08 64.01,37.08 64.26,37.34 64.26,38.54 RESET.3 64.22,38.86 64.22,42.29 RESET.4 | v38.1,33.53 38.86,34.29 J16.RST
  Bottom 0.2: v41.27,21.27 41.59,21.27 42.23,20.64 45.72,20.64 | v45.72,20 45.72,20.64 | 45.72,20.64 60.52,20.64 v60.71,20.83 | v40.39,25.65 39.75,26.29 38.61,26.29 37.34,27.56 37.34,32.77 v38.1,33.53
RX  (via drill 0.3)
  Top 0.2: v41.91,16.19 42.55,16.19 42.66,16.31 T10.4 42.91,16.88 43.18,17.14 43.18,17.33 R6.2 | v47.62,10.48 47.62,8.96 JRX.2
  Bottom 0.2: v41.91,16.19 41.27,15.56 41.27,13.97 44.77,10.48 v47.62,10.48
RX_D0  (via drill 0.3)
  Top 0.2: v42.55,21.27 42,20.73 IC1.30 42,19.28 42.55,18.73 42.55,17.78 42.23,17.46 v42.23,17.14 | v48.26,21.91 R7.2 | v41.91,14.92 42.8,14.92 T10.6
  Bottom 0.2: v42.55,21.27 47.62,21.27 v48.26,21.91 50.01,21.91 51.44,23.34 54.96,23.34 55.5,23.88 55.5,24.29 J1.4-TXO | v42.23,17.14 42.55,16.83 42.55,15.56 v41.91,14.92
SCK  (via drill 0.3)
  Top 0.2: J3.18 21.91,22.84 21.91,21.27 20.32,19.68 v20.32,12.06
  Bottom 0.2: v20.32,12.06 22.86,12.06 28.57,6.35 28.57,4.88 RPI.23
SCL  (via drill 0.3)
  Top 0.2: J3.36 12.89,22.09 11.75,20.95 v11.43,20.95 | 39.45,17.55 39.51,17.6 | v40.32,18.41 39.53,17.62 39.51,17.6 | v41.59,11.11 v41.59,9.84 | T9.4 39.1,17.06 R2.2 39.51,17.6
  Bottom 0.2: v11.43,20.95 22.86,20.95 30.8,13.02 33.97,13.02 35.56,11.43 36.83,11.43 38.42,9.84 v41.59,9.84 43.5,7.94 44.45,7.94 45.09,7.3 47.31,7.3 48.58,6.03 50.29,6.03 RPI.5 | v40.32,18.41 40.32,14.29 41.59,13.02 v41.59,11.11
SCL_A5  (via drill 0.3)
  Top 0.2: T9.3 40.91,16.46 41.27,16.83 41.27,18.41 | 41.27,18.41 40.32,19.37 40.32,19.92 IC1.28 | 41.27,18.41 v41.91,18.41 | v48.26,18.1 R4.2
  Bottom 0.2: v41.91,18.41 47.94,18.41 v48.26,18.1
SDA  (via drill 0.3)
  Top 0.2: J3.38 11.89,22.05 11.43,21.59 v10.79,21.59 | v40.96,12.38 40.55,12.79 40.55,13.6 R1.2 40.91,14.05 T9.1
  Bottom 0.2: v10.79,21.59 22.86,21.59 30.8,13.65 33.97,13.65 35.56,12.06 36.83,12.06 38.42,10.48 40.96,10.48 | 40.96,10.48 42.23,10.48 44.13,8.57 44.77,8.57 45.4,7.94 47.47,7.94 48.74,6.67 52.19,6.67 RPI.3 | v40.96,12.38 40.96,10.48
SDA_A4  (via drill 0.3)
  Top 0.2: T9.6 38.85,14.81 38.42,15.24 38.42,15.56 | 38.42,15.56 38.42,17.78 39.6,18.96 IC1.27 39.69,20.09 | v38.1,15.56 38.42,15.56 | R3.2 49.35,16.06 v49.53,15.88
  Bottom 0.2: v49.53,15.88 49.53,18.1 48.58,19.05 43.18,19.05 42.86,19.37 39.53,19.37 38.73,18.57 38.73,16.19 v38.1,15.56
TX
  Top 0.2: JTX.2 45.88,11.27 44.32,12.83 44.32,13.64 R5.2 44.72,14.05 T10.1
TX_D1  (via drill 0.3)
  Top 0.2: IC1.31 42.8,19.11 43.18,18.73 44.45,18.73 | 44.45,18.73 45.09,18.1 45.09,16.68 | 45.09,16.68 T10.3 | R8.2 45.4,20.64 44.45,19.68 44.45,18.73 | 57.63,17.94 v57.47,17.78 | v45.56,13.81 45.4,13.97 45.4,16.36 45.09,16.68
  Top 0.254: v58.67,21.72 58.67,18.99 v57.47,17.78
  Bottom 0.2: v57.47,17.78 54.45,14.76 46.51,14.76 v45.56,13.81
  Bottom 0.254: J1.5-RXI 58.42,21.97 v58.67,21.72
V+
  Top 0.2: 13.57,47.42 13.89,47.42 D1B.1
  Top 0.8: V-REG.1 55.4,24.45
  Top 1.016: C9.2 59.18,47.5 D3B.1 | 35.56,50.35 35.5,50.42 C8.2
  Top 1.27: 13.57,47.42 11.16,47.42 C7.2 | D1B.1 16.13,47.5 18.03,49.4 18.03,52.83 19.18,53.98 20.83,53.98 22.1,52.7 22.1,50.29 22.73,49.66 35.56,49.66
  Top 1.676: C11.2 56.56,11.4 arc-90 56.61,11.35
  Top 1.93: 35.56,50.04 35.69,49.91 50.29,49.91 51.9,48.31 VIN1.3 55.32,48.31 56.13,47.5 D3B.1
  Top 2: D2B.1 35.56,49.66 35.56,50.04 35.56,50.35 | 56.61,11.35 VIN.3 56.69,13.79 55.4,15.08 55.4,24.45 55.4,43.21 53.34,45.28 VIN1.3
VCC_FTDI
  Bottom 0.2: J1.3-VCC 58.67,27.05 58.93,27.3 60.08,27.3 JVCC.2

### Text on the board
tPlace: 2B | 1B | 1A | 2A | 2B | 1B | 1A | 2A | 2B | 1B | 1A | 2A | Vmot | C3 | C2 | C1 | C3 | C2 | C1 | En | Vmot | En | En | Vmot | www.watterott.com | +5V | +5V | C3 | C2 | C1 | GND | GND | +5V | - | - | Reset | + | Servo / opt. | + | Servo / opt. | GND | S | S | Stepper / Turn / Table | Stepper / Laser / 1 | Stepper / Laser / 2 | Inp. | Laser / 2 | +V / GND | DC/DC / min. 2A | Secur / ity / Switch | 5V | Laser / 1 | RPi FabScan HAT | www.fabscan.org | +V / GND | WS2812 / Ring | WP | JTx | JRx | JBL | RPi-ID / EEPROM | V1.2
bPlace: 2B | 1B | 1A | 2A | 2B | 1B | 1A | 2A | 2B | 1B | 1A | 2A | GND | +V / GND | Laser / 2 | FTDI / connector | Secur / ity / Switch | DTR | +V / GND | Laser / 1 | WS2812 / Ring
Reference: Silkscreen: 21 tPlace + 22 bPlace